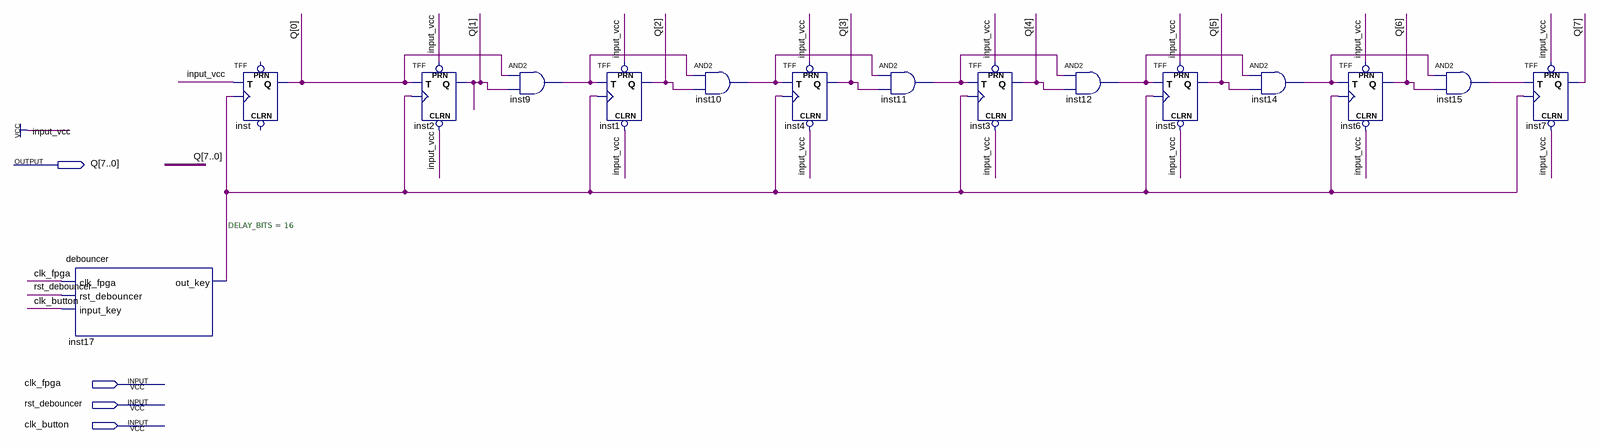
[diagram p0: schematic sheet]
// Quartus schematic contador_sincrono.bdf as structural Verilog: 15 symbols, 4 pins
module contador_sincrono (
  input  clk_fpga,
  input  rst_debouncer,
  input  clk_button,
  output [7:0] Q
);

  wire inst9_out, inst10_out, inst11_out, inst12_out, inst14_out, inst15_out, inst17_out_key;

  debouncer #(.DELAY_BITS(16)) inst17 (
    .clk_fpga(clk_fpga), .rst_debouncer(rst_debouncer), .input_key(clk_button), .out_key(inst17_out_key));
  TFF inst (.T(1'b1), .CLK(inst17_out_key), .Q(Q[0]));  // open: PRN, CLRN
  TFF inst2 (.PRN(1'b1), .CLRN(1'b1), .T(Q[0]), .CLK(inst17_out_key), .Q(Q[1]));
  and inst9 (inst9_out, Q[0], Q[1]);
  TFF inst1 (.PRN(1'b1), .CLRN(1'b1), .T(inst9_out), .CLK(inst17_out_key), .Q(Q[2]));
  and inst10 (inst10_out, inst9_out, Q[2]);
  TFF inst4 (.PRN(1'b1), .CLRN(1'b1), .T(inst10_out), .CLK(inst17_out_key), .Q(Q[3]));
  and inst11 (inst11_out, inst10_out, Q[3]);
  TFF inst3 (.PRN(1'b1), .CLRN(1'b1), .T(inst11_out), .CLK(inst17_out_key), .Q(Q[4]));
  and inst12 (inst12_out, inst11_out, Q[4]);
  TFF inst5 (.PRN(1'b1), .CLRN(1'b1), .T(inst12_out), .CLK(inst17_out_key), .Q(Q[5]));
  and inst14 (inst14_out, inst12_out, Q[5]);
  TFF inst6 (.PRN(1'b1), .CLRN(1'b1), .T(inst14_out), .CLK(inst17_out_key), .Q(Q[6]));
  and inst15 (inst15_out, inst14_out, Q[6]);
  TFF inst7 (.PRN(1'b1), .CLRN(1'b1), .T(inst15_out), .CLK(inst17_out_key), .Q(Q[7]));
endmodule
